# Altium project Havashenasi.PrjPcb
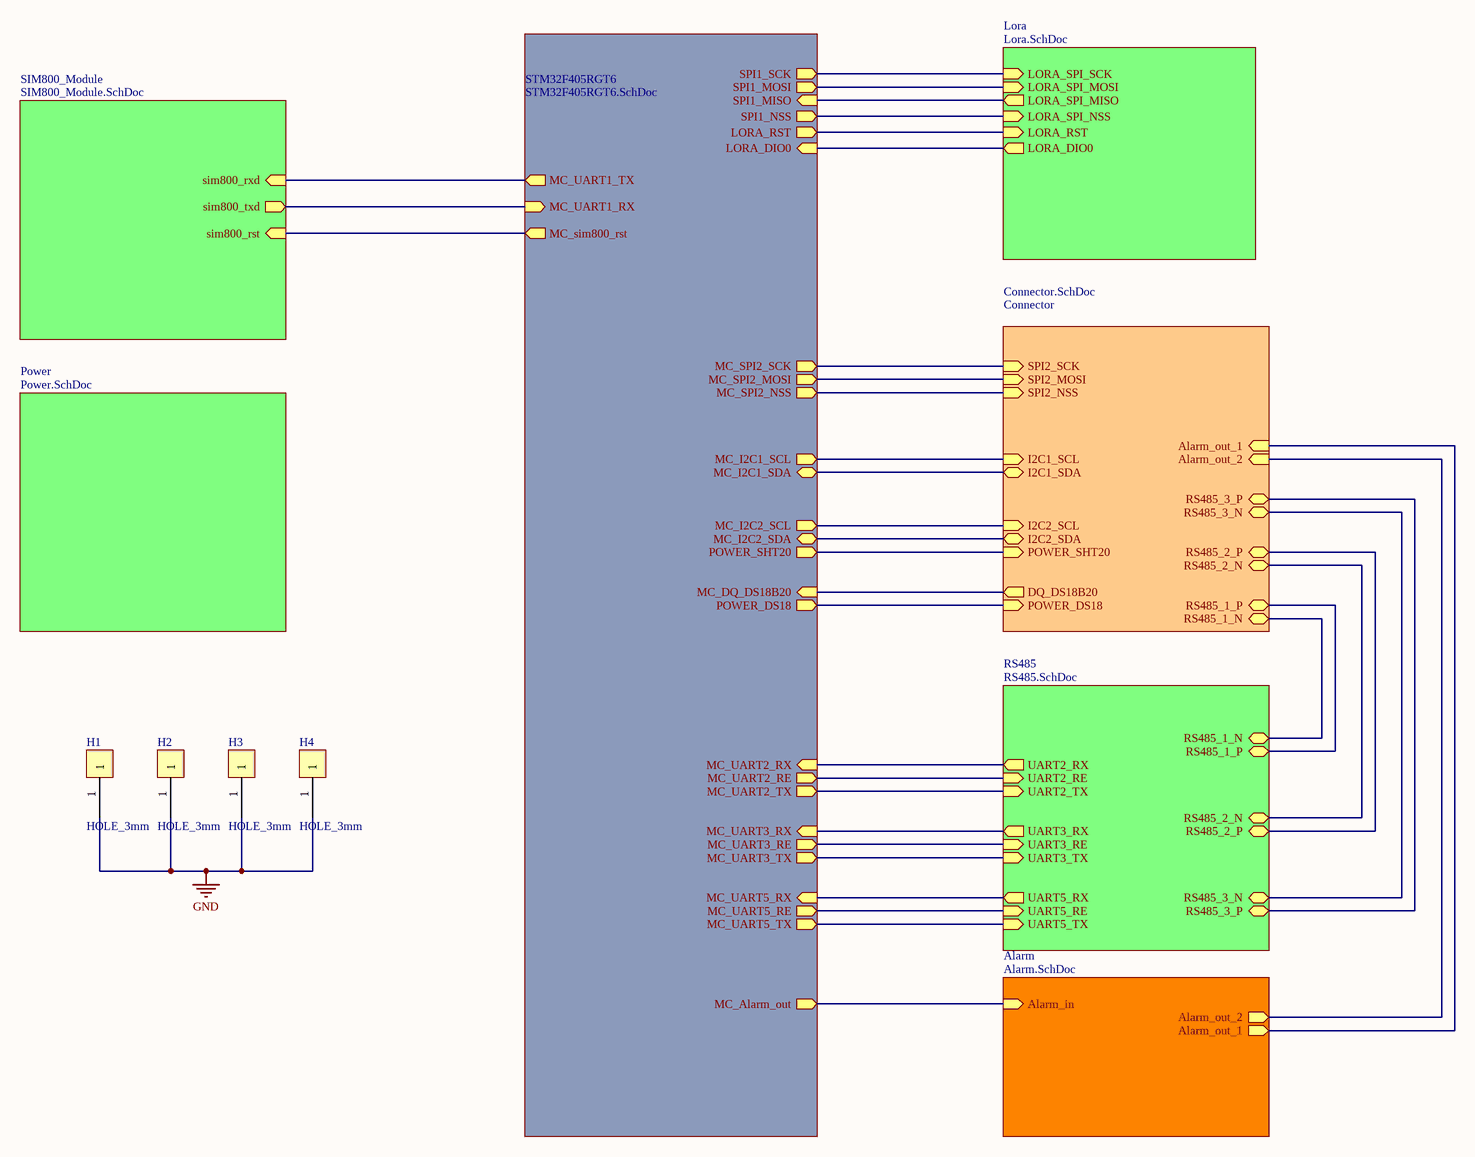
[diagram p0: Havashenasi.SchDoc]
8 sheets, 76 parts. Net scope: hierarchical (ports join the sheet entries above them; power ports are global).
Board file: Havashenasi.PcbDoc
Sheets:
  Havashenasi.SchDoc
    STM32F405RGT6 = STM32F405RGT6.SchDoc
    Power = Power.SchDoc
    SIM800_Module = SIM800_Module.SchDoc
    Connector = Connector.SchDoc
    RS485 = RS485.SchDoc
    Alarm = Alarm.SchDoc
    Lora = Lora.SchDoc

## Sheet Havashenasi.SchDoc
size A3

### Parts
H1  HOLE_3mm  [Hole_3mm]
H2  HOLE_3mm  [Hole_3mm]
H3  HOLE_3mm  [Hole_3mm]
H4  HOLE_3mm  [Hole_3mm]

### Sub-sheets
Alarm = Alarm.SchDoc: Alarm_out_2 (out), Alarm_out_1 (out), Alarm_in (in)
Connector = Connector.SchDoc: I2C2_SDA (bidir), I2C2_SCL (in), I2C1_SDA (bidir), I2C1_SCL (in), RS485_1_P (bidir), RS485_1_N (bidir), RS485_2_P (bidir), RS485_2_N (bidir), RS485_3_P (bidir), RS485_3_N (bidir), DQ_DS18B20 (out), Alarm_out_2 (in), Alarm_out_1 (in), SPI2_SCK (in), SPI2_MOSI (in), SPI2_NSS (in), POWER_SHT20 (in), POWER_DS18 (in)
Lora = Lora.SchDoc: LORA_SPI_MISO (out), LORA_RST (in), LORA_SPI_MOSI (in), LORA_SPI_SCK (in), LORA_SPI_NSS (in), LORA_DIO0 (out)
Power = Power.SchDoc: no entries
RS485 = RS485.SchDoc: UART3_RE (in), RS485_1_N (bidir), UART5_RE (in), UART2_TX (in), RS485_1_P (bidir), UART2_RE (in), UART3_TX (in), RS485_2_P (bidir), UART3_RX (out), RS485_2_N (bidir), UART2_RX (out), RS485_3_N (bidir), RS485_3_P (bidir), UART5_RX (out), UART5_TX (in)
SIM800_Module = SIM800_Module.SchDoc: sim800_rxd (in), sim800_txd (out), sim800_rst (in)
STM32F405RGT6 = STM32F405RGT6.SchDoc: MC_I2C2_SCL (out), MC_I2C2_SDA (bidir), MC_UART1_TX (out), MC_UART1_RX (in), MC_I2C1_SCL (out), MC_I2C1_SDA (bidir), MC_UART2_TX (out), MC_UART2_RX (in), MC_UART3_TX (out), MC_UART3_RX (in), MC_UART5_TX (out), MC_UART5_RX (in), MC_UART3_RE (out), MC_UART2_RE (out), MC_UART5_RE (out), MC_sim800_rst (out), MC_DQ_DS18B20 (in), MC_Alarm_out (out), MC_SPI2_MOSI (out), MC_SPI2_SCK (out), MC_SPI2_NSS (out), POWER_DS18 (out), POWER_SHT20 (out), SPI1_NSS (out), SPI1_SCK (out), SPI1_MISO (in), SPI1_MOSI (out), LORA_RST (out), LORA_DIO0 (in)

### Nets
GND: H1.1 H2.1 H3.1 H4.1
Alarm_out_1: sheet Connector/Alarm_out_1, sheet Alarm/Alarm_out_1
Alarm_out_2: sheet Connector/Alarm_out_2, sheet Alarm/Alarm_out_2
LORA_DIO0: sheet STM32F405RGT6/LORA_DIO0, sheet Lora/LORA_DIO0
LORA_RST: sheet STM32F405RGT6/LORA_RST, sheet Lora/LORA_RST
LORA_SPI_MISO: sheet STM32F405RGT6/SPI1_MISO, sheet Lora/LORA_SPI_MISO
LORA_SPI_MOSI: sheet STM32F405RGT6/SPI1_MOSI, sheet Lora/LORA_SPI_MOSI
LORA_SPI_NSS: sheet STM32F405RGT6/SPI1_NSS, sheet Lora/LORA_SPI_NSS
LORA_SPI_SCK: sheet STM32F405RGT6/SPI1_SCK, sheet Lora/LORA_SPI_SCK
MC_Alarm_out: sheet STM32F405RGT6/MC_Alarm_out, sheet Alarm/Alarm_in
MC_DQ_DS18B20: sheet STM32F405RGT6/MC_DQ_DS18B20, sheet Connector/DQ_DS18B20
MC_I2C1_SCL: sheet STM32F405RGT6/MC_I2C1_SCL, sheet Connector/I2C1_SCL
MC_I2C1_SDA: sheet STM32F405RGT6/MC_I2C1_SDA, sheet Connector/I2C1_SDA
MC_I2C2_SCL: sheet STM32F405RGT6/MC_I2C2_SCL, sheet Connector/I2C2_SCL
MC_I2C2_SDA: sheet STM32F405RGT6/MC_I2C2_SDA, sheet Connector/I2C2_SDA
MC_sim800_rst: sheet STM32F405RGT6/MC_sim800_rst, sheet SIM800_Module/sim800_rst
MC_SPI2_MOSI: sheet STM32F405RGT6/MC_SPI2_MOSI, sheet Connector/SPI2_MOSI
MC_SPI2_NSS: sheet STM32F405RGT6/MC_SPI2_NSS, sheet Connector/SPI2_NSS
MC_SPI2_SCK: sheet STM32F405RGT6/MC_SPI2_SCK, sheet Connector/SPI2_SCK
MC_UART1_RX: sheet STM32F405RGT6/MC_UART1_RX, sheet SIM800_Module/sim800_txd
MC_UART1_TX: sheet STM32F405RGT6/MC_UART1_TX, sheet SIM800_Module/sim800_rxd
MC_UART2_RX: sheet STM32F405RGT6/MC_UART2_RX, sheet RS485/UART2_RX
MC_UART2_TX: sheet STM32F405RGT6/MC_UART2_TX, sheet RS485/UART2_TX
MC_UART3_RX: sheet STM32F405RGT6/MC_UART3_RX, sheet RS485/UART3_RX
MC_UART3_TX: sheet STM32F405RGT6/MC_UART3_TX, sheet RS485/UART3_TX
MC_UART5_RX: sheet STM32F405RGT6/MC_UART5_RX, sheet RS485/UART5_RX
MC_UART5_TX: sheet STM32F405RGT6/MC_UART5_TX, sheet RS485/UART5_TX
RS485_1_N: sheet Connector/RS485_1_N, sheet RS485/RS485_1_N
RS485_1_P: sheet Connector/RS485_1_P, sheet RS485/RS485_1_P
RS485_2_N: sheet Connector/RS485_2_N, sheet RS485/RS485_2_N
RS485_2_P: sheet Connector/RS485_2_P, sheet RS485/RS485_2_P
RS485_3_N: sheet Connector/RS485_3_N, sheet RS485/RS485_3_N
RS485_3_P: sheet Connector/RS485_3_P, sheet RS485/RS485_3_P
UART2_RE: sheet STM32F405RGT6/MC_UART2_RE, sheet RS485/UART2_RE
UART3_RE: sheet STM32F405RGT6/MC_UART3_RE, sheet RS485/UART3_RE
UART5_RE: sheet STM32F405RGT6/MC_UART5_RE, sheet RS485/UART5_RE
(unnamed): sheet STM32F405RGT6/POWER_DS18, sheet Connector/POWER_DS18
(unnamed): sheet STM32F405RGT6/POWER_SHT20, sheet Connector/POWER_SHT20

## Sheet STM32F405RGT6.SchDoc
size A3
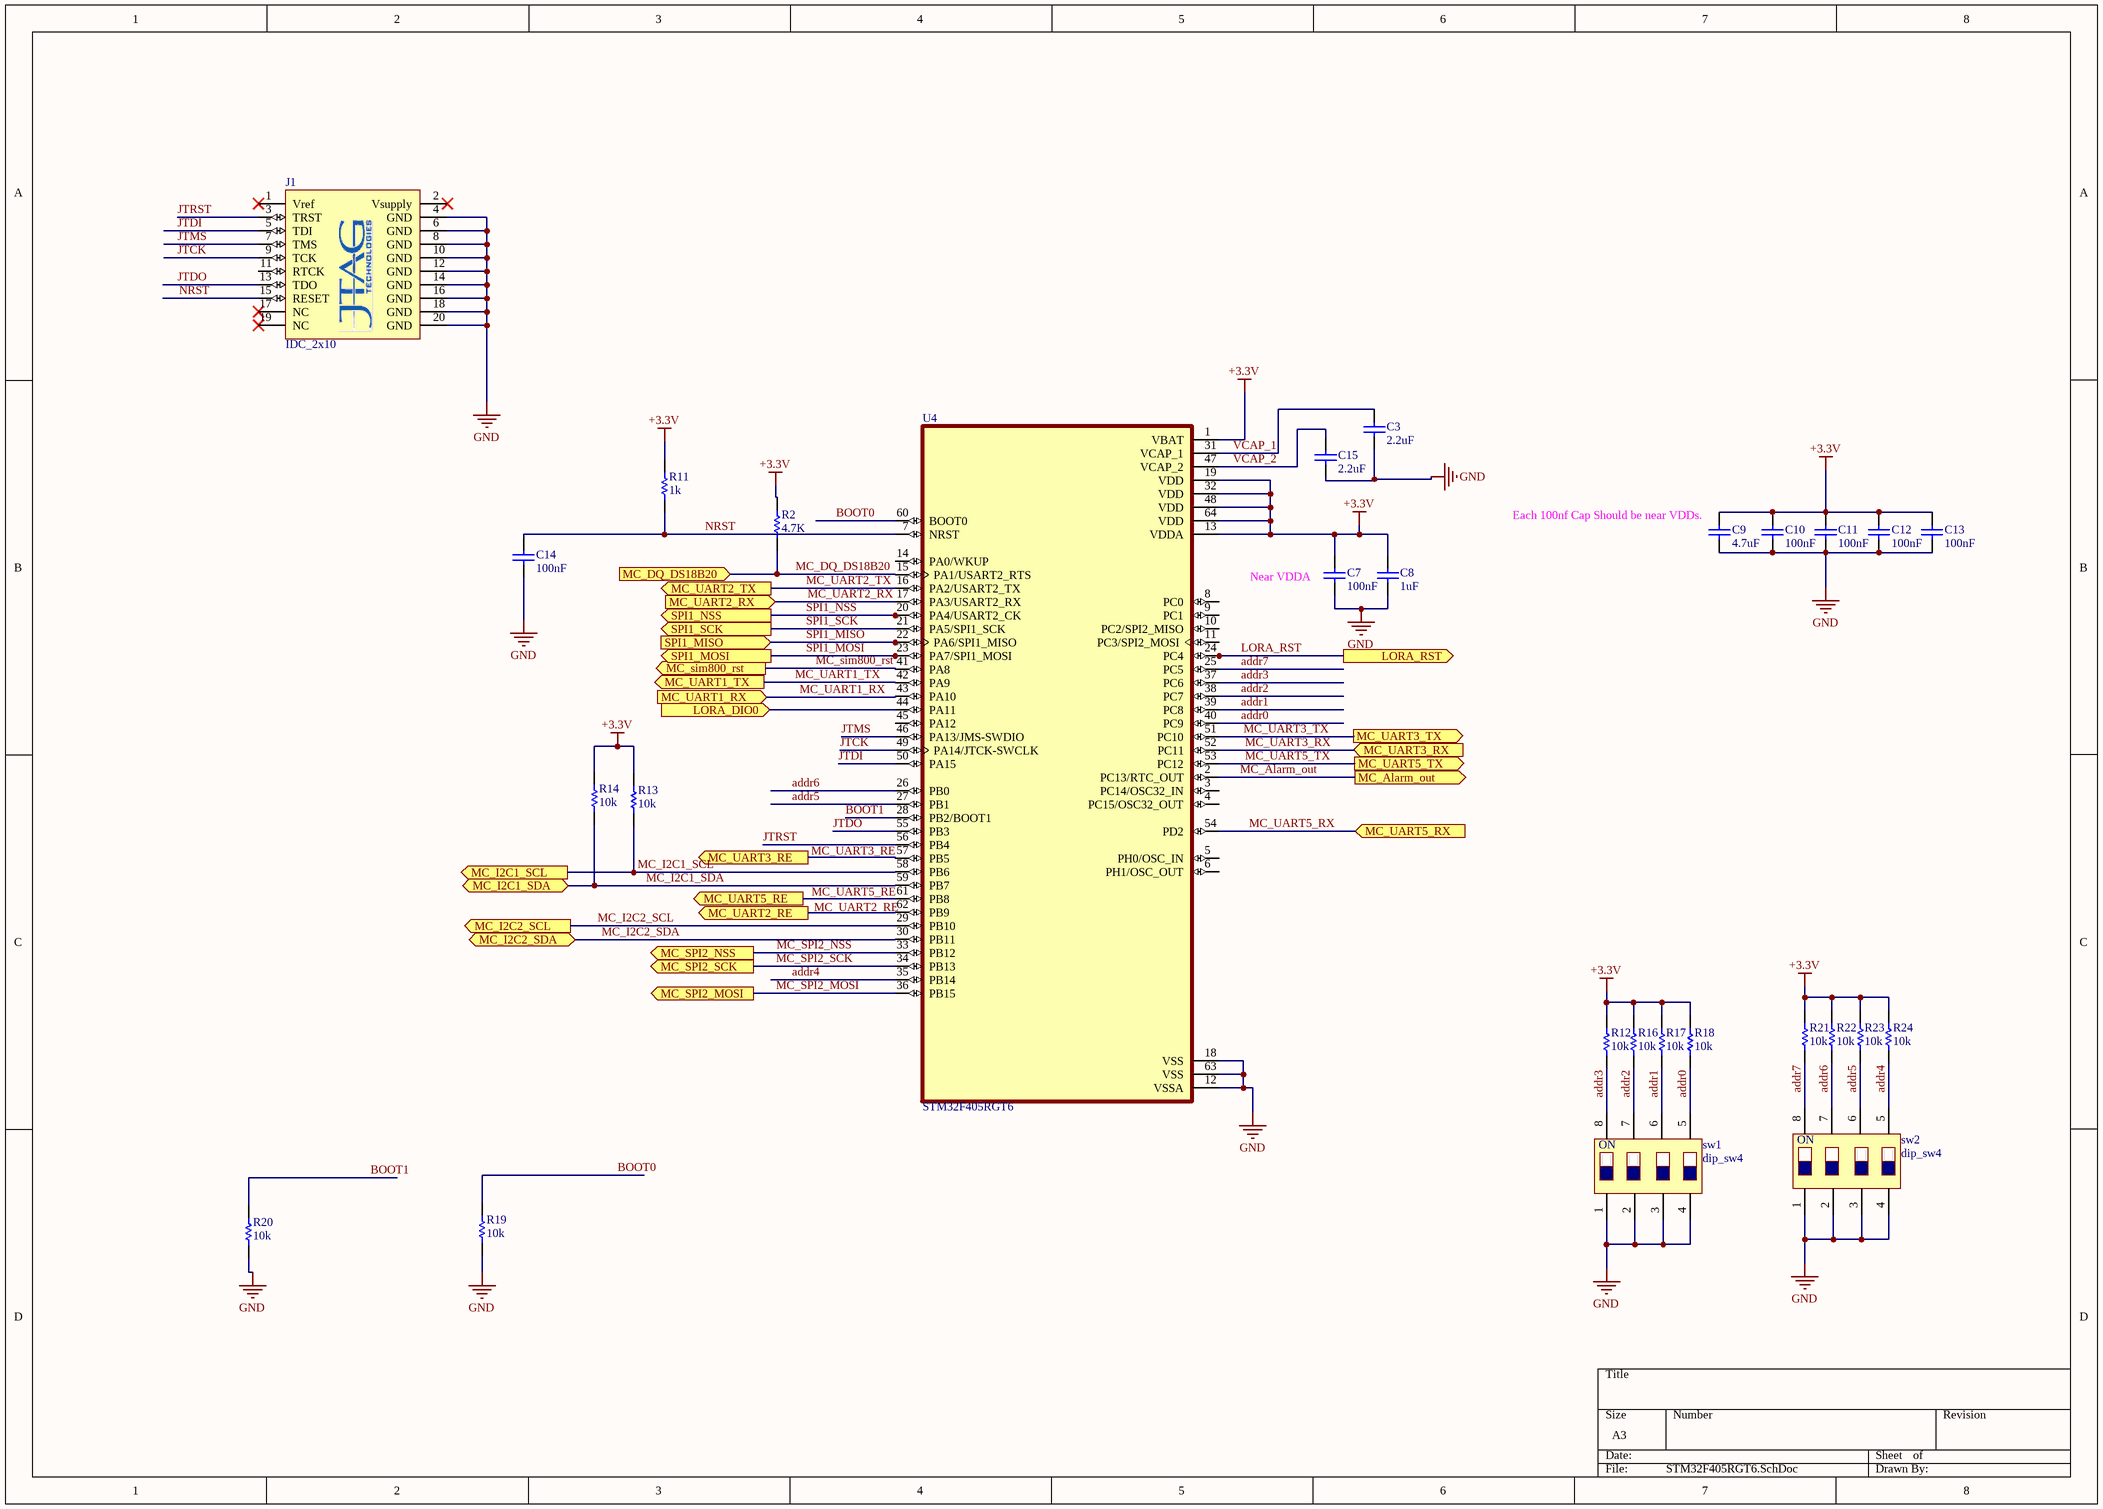
[diagram p1: STM32F405RGT6.SchDoc]

### Parts
C3  value 2.2uF  [C-805]  (hidden comment: C-805)
C7  value 100nF  [C-805]  (hidden comment: C-805)
C8  value 1uF  [C-805]  (hidden comment: C-805)
C9  value 4.7uF  [C-1206]  (hidden comment: C-1206)
C10  value 100nF  [C-603]  (hidden comment: C-603)
C11  value 100nF  [C-603]  (hidden comment: C-603)
C12  value 100nF  [C-603]  (hidden comment: C-603)
C13  value 100nF  [C-603]  (hidden comment: C-603)
C14  value 100nF  [C-805]  (hidden comment: C-805)
C15  value 2.2uF  [C-805]  (hidden comment: C-805)
J1  IDC_2x10  [IDC2.54-V20D]
R2  value 4.7K  [R-805]  (hidden comment: R-805)
R11  value 1k  [R-805]  (hidden comment: R-805)
R12  value 10k  [R-805]  (hidden comment: R-805)
R13  value 10k  [R-805]  (hidden comment: R-805)
R14  value 10k  [R-805]  (hidden comment: R-805)
R16  value 10k  [R-805]  (hidden comment: R-805)
R17  value 10k  [R-805]  (hidden comment: R-805)
R18  value 10k  [R-805]  (hidden comment: R-805)
R19  value 10k  [R-805]  (hidden comment: R-805)
R20  value 10k  [R-805]  (hidden comment: R-805)
R21  value 10k  [R-805]  (hidden comment: R-805)
R22  value 10k  [R-805]  (hidden comment: R-805)
R23  value 10k  [R-805]  (hidden comment: R-805)
R24  value 10k  [R-805]  (hidden comment: R-805)
sw1  dip_sw4  [dipSW_4]
sw2  dip_sw4  [dipSW_4]
U4  STM32F405RGT6  [stm32f405rgt6]

### Ports
LORA_DIO0 (in), LORA_RST (out), MC_Alarm_out (out), MC_DQ_DS18B20 (in), MC_I2C1_SCL (out), MC_I2C1_SDA (bidir), MC_I2C2_SCL (out), MC_I2C2_SDA (bidir), MC_sim800_rst (out), MC_SPI2_MOSI (out), MC_SPI2_NSS (out), MC_SPI2_SCK (out), MC_UART1_RX (in), MC_UART1_TX (out), MC_UART2_RE (out), MC_UART2_RX (in), MC_UART2_TX (out), MC_UART3_RE (out), MC_UART3_RX (in), MC_UART3_TX (out), MC_UART5_RE (out), MC_UART5_RX (in), MC_UART5_TX (out), SPI1_MISO (in), SPI1_MOSI (out), SPI1_NSS (out), SPI1_SCK (out)

### Nets
+3.3V: C7.1 C8.2 C9.2 C10.1 C11.1 C12.1 C13.1 R2.2 R11.2 R12.2 R13.2 R14.2 R16.2 R17.2 R18.2 R21.2 R22.2 R23.2 R24.2 U4.1(VBAT) U4.13(VDDA) U4.19(VDD) U4.32(VDD) U4.48(VDD) U4.64(VDD)
GND: C3.1 C7.2 C8.1 C9.1 C10.2 C11.2 C12.2 C13.2 C14.2 C15.1 J1.4(GND) J1.6(GND) J1.8(GND) J1.10(GND) J1.12(GND) J1.14(GND) J1.16(GND) J1.18(GND) J1.20(GND) R19.1 R20.2 sw1.1 sw1.2 sw1.3 sw1.4 sw2.1 sw2.2 sw2.3 sw2.4 U4.12(VSSA) U4.18(VSS) U4.63(VSS)
addr0: R18.1 sw1.5 U4.40(PC9)
addr1: R17.1 sw1.6 U4.39(PC8)
addr2: R16.1 sw1.7 U4.38(PC7)
addr3: R12.1 sw1.8 U4.37(PC6)
addr4: R24.1 sw2.5 U4.35(PB14)
addr5: R23.1 sw2.6 U4.27(PB1)
addr6: R22.1 sw2.7 U4.26(PB0)
addr7: R21.1 sw2.8 U4.25(PC5)
BOOT0: R19.2 U4.60(BOOT0)
BOOT1: R20.1 U4.28(PB2/BOOT1)
JTCK: J1.9(TCK) U4.49(PA14/JTCK-SWCLK)
JTDI: J1.5(TDI) U4.50(PA15)
JTDO: J1.13(TDO) U4.55(PB3)
JTMS: J1.7(TMS) U4.46(PA13/JMS-SWDIO)
JTRST: J1.3(TRST) U4.56(PB4)
LORA_DIO0: U4.44(PA11) ; port LORA_DIO0
LORA_RST: U4.24(PC4) ; port LORA_RST
MC_Alarm_out: U4.2(PC13/RTC_OUT) ; port MC_Alarm_out
MC_DQ_DS18B20: R2.1 U4.15(PA1/USART2_RTS) ; port MC_DQ_DS18B20
MC_I2C1_SCL: R13.1 U4.58(PB6) ; port MC_I2C1_SCL
MC_I2C1_SDA: R14.1 U4.59(PB7) ; port MC_I2C1_SDA
MC_I2C2_SCL: U4.29(PB10) ; port MC_I2C2_SCL
MC_I2C2_SDA: U4.30(PB11) ; port MC_I2C2_SDA
MC_sim800_rst: U4.41(PA8) ; port MC_sim800_rst
MC_SPI2_MOSI: U4.36(PB15) ; port MC_SPI2_MOSI
MC_SPI2_NSS: U4.33(PB12) ; port MC_SPI2_NSS
MC_SPI2_SCK: U4.34(PB13) ; port MC_SPI2_SCK
MC_UART1_RX: U4.43(PA10) ; port MC_UART1_RX
MC_UART1_TX: U4.42(PA9) ; port MC_UART1_TX
MC_UART2_RX: U4.17(PA3/USART2_RX) ; port MC_UART2_RX
MC_UART2_TX: U4.16(PA2/USART2_TX) ; port MC_UART2_TX
MC_UART3_RX: U4.52(PC11) ; port MC_UART3_RX
MC_UART3_TX: U4.51(PC10) ; port MC_UART3_TX
MC_UART5_RX: U4.54(PD2) ; port MC_UART5_RX
MC_UART5_TX: U4.53(PC12) ; port MC_UART5_TX
NRST: C14.1 J1.15(RESET) R11.1 U4.7(NRST)
SPI1_MISO: U4.22(PA6/SPI1_MISO) ; port SPI1_MISO  [project net LORA_SPI_MISO]
SPI1_MOSI: U4.23(PA7/SPI1_MOSI) ; port SPI1_MOSI  [project net LORA_SPI_MOSI]
SPI1_NSS: U4.20(PA4/USART2_CK) ; port SPI1_NSS  [project net LORA_SPI_NSS]
SPI1_SCK: U4.21(PA5/SPI1_SCK) ; port SPI1_SCK  [project net LORA_SPI_SCK]
UART2_RE: U4.62(PB9) ; port MC_UART2_RE
UART3_RE: U4.57(PB5) ; port MC_UART3_RE
UART5_RE: U4.61(PB8) ; port MC_UART5_RE
VCAP_1: C3.2 U4.31(VCAP_1)
VCAP_2: C15.2 U4.47(VCAP_2)

Not connected (* = marked no-connect by the designer): J1 1(Vref)* 2(Vsupply)* 11(RTCK) 17(NC)* 19(NC)*; U4 3(PC14/OSC32_IN) 4(PC15/OSC32_OUT) 5(PH0/OSC_IN) 6(PH1/OSC_OUT) 8(PC0) 9(PC1) 10(PC2/SPI2_MISO) 11(PC3/SPI2_MOSI) 14(PA0/WKUP) 45(PA12)

### Notes on the sheet
- (near C9) Each 100nf Cap Should be near VDDs.
- (near C7) Near VDDA
- Labels drawn without touching a wire or pin: MC_UART2_RE, MC_UART3_RE, MC_UART5_RE
- (in symbol dip_sw4) ON

### Library data of the parts
C3 C7 C8 C14 C15 = C-805: Capacitor; Published: 8-Jun-2000; LatestRevisionDate: 29-May-2009; LatestRevisionNote: IPC-7351 Footprint Added.; PackageReference: C1206; Publisher: Altium Limited; PackageDescription: Chip Capacitor
C9 = C-1206: Capacitor; Published: 8-Jun-2000; LatestRevisionDate: 29-May-2009; LatestRevisionNote: IPC-7351 Footprint Added.; PackageReference: C1206; Publisher: Altium Limited; PackageDescription: Chip Capacitor
C10-C13 = C-603: Capacitor; Published: 8-Jun-2000; LatestRevisionDate: 29-May-2009; LatestRevisionNote: IPC-7351 Footprint Added.; PackageReference: C1206; Publisher: Altium Limited; PackageDescription: Chip Capacitor
J1 = JTAG_JLINK: 20 Pin Standard JTAG Header For ARM JLINK; Company: SJ Libraries; Connector type: IDC2.54-20; designer: Eng. Saeid Jorablo; Max Current: mA; Positions: 20; Revision 1: 7/8/2012: Create Model; Category: Headers; ComponentLink1Description: Datasheet; ComponentLink2Description: Reference; Mounting Technology: Through-Hole; Orientation: Vertical; Pin Count: 20; Publisher: SJ UnLimited; Status: Unreleased; Update: 7/8/2012; HelpURL: http://s3.picofile.com/file/7443264187/Coming_Soon_logo.gif
R2 R11-R14 R16-R24 = R-805: Resistor
sw1 sw2 = dip_sw4: dip switch, 4-Pin; LatestRevisionDate: 17-Jul-2002; LatestRevisionNote: Re-released for DXP Platform.; Publisher: Altium Limited
U4 = STM32F405RGT6: ARMÂ® CortexÂ®-M4 STM32F4 Microcontroller IC 32-Bit 168MHz 1MB _1M x 8_ FLASH 64-LQFP _10x10_; MF: STMicroelectronics; Package: LQFP-64 STMicroelectronics; Digi-Key_Purchase_URL: https://www.digikey.com/product-detail/en/stmicroelectronics/STM32F405RGT6/497-11767-ND/2754208?utm_source=snapeda&utm_medium=aggregator&utm_campaign=symbol; Value: *; MP: STM32F405RGT6; SnapEDA_Link: https://www.snapeda.com/parts/STM32F405RGT6/STMicroelectronics/view-part/105502/?ref=snap; Digi-Key_Part_Number: 497-11767-ND

## Sheet Power.SchDoc
size A3
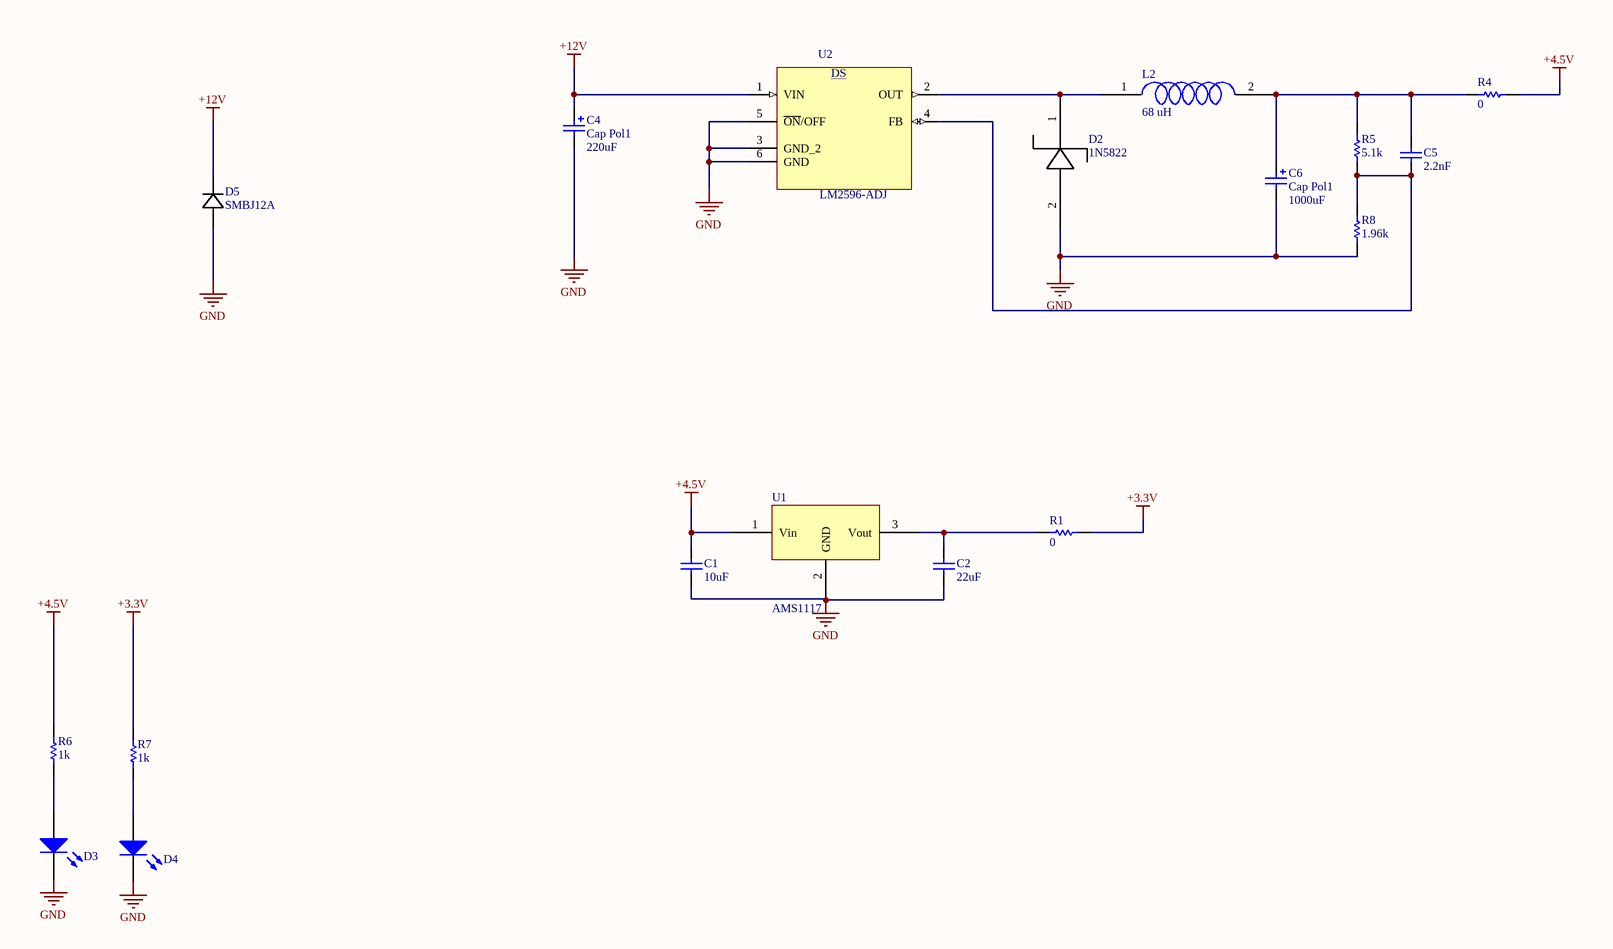
[diagram p2: Power.SchDoc]

### Parts
C1  value 10uF  [C-1206]  (hidden comment: C-1206)
C2  value 22uF  [C-1206]  (hidden comment: C-1206)
C4  Cap Pol1  value 220uF  [RB5-10.5]
C5  value 2.2nF  [C-805]  (hidden comment: C-805)
C6  Cap Pol1  value 1000uF  [RB5-10.5]
D2  1N5822  [1N5822]
D3  LED-805  [LED-805]  (value not drawn)
D4  LED-805  [LED-805]  (value not drawn)
D5  SMBJ12A  [SMB]
L2  68 uH  [Inductor]
R1  value 0  [R-1206]  (hidden comment: R-1206)
R4  value 0  [R-1206]  (hidden comment: R-1206)
R5  value 5.1k  [R-805]  (hidden comment: R-805)
R6  value 1k  [R-805]  (hidden comment: R-805)
R7  value 1k  [R-805]  (hidden comment: R-805)
R8  value 1.96k  [R-805]  (hidden comment: R-805)
U1  AMS1117  [AMS1117]
U2  LM2596-ADJ  [LM2596SX]

### Nets
+3.3V: R1.2 R7.2
+4.5V: C1.2 R4.2 R6.2 U1.1(Vin)
+12V: C4.1 D5.1 U2.1(VIN)
GND: C1.1 C2.1 C4.2 C6.2 D2.2 D3.2(K) D4.2(K) D5.2 R8.2 U1.2(GND) U2.3(GND_2) U2.5(~{ON}/OFF) U2.6(GND)
NetC2_2: C2.2 R1.1 U1.3(Vout)
NetC5_1: C5.1 R5.2 R8.1 U2.4(FB)
NetC5_2: C5.2 C6.1 L2.2 R4.1 R5.1
NetD2_1: D2.1 L2.1 U2.2(OUT)
NetD3_1: D3.1(A) R6.1
NetD4_1: D4.1(A) R7.1

### Notes on the sheet
- (in symbol LM2596-ADJ) DS

### Library data of the parts
C1 C2 = C-1206: Capacitor; Published: 8-Jun-2000; LatestRevisionDate: 29-May-2009; LatestRevisionNote: IPC-7351 Footprint Added.; PackageReference: C1206; Publisher: Altium Limited; PackageDescription: Chip Capacitor
C4 C6 = Cap Pol1: Polarized Capacitor (Radial); Published: 8-Jun-2000; LatestRevisionDate: 17-Jul-2002; LatestRevisionNote: Re-released for DXP Platform.; PackageReference: RB7.6-15; Publisher: Altium Limited; PackageDescription: Polarized Capacitor (Radial); 2 Leads
C5 = C-805: Capacitor; Published: 8-Jun-2000; LatestRevisionDate: 29-May-2009; LatestRevisionNote: IPC-7351 Footprint Added.; PackageReference: C1206; Publisher: Altium Limited; PackageDescription: Chip Capacitor
D3 D4 = LED-805: LED Size 805; Published: 8-Jun-2000; LatestRevisionDate: 17-Jul-2002; LatestRevisionNote: Re-released for DXP Platform.; PackageVersion: Feb-2002; PackageReference: 3.2X1.6X1.1; Publisher: Altium Limited; PackageDescription: SM LED; 2 Flat Leads
D5 = SMBJ12A: No Description Available; Manufacturer_Part_Number: SMBJ12A-13-F; Vendor: Diodes Inc; Built_By: EMA_UL_Team; Type: DEV; Copyright: Copyright (C) 2018 Accelerated Designs. All rights reserved; RefDes: RefDes; Value: Value
L2 = Inductor: Power inductor
R1 R4 = R-1206: Resistor
R5-R8 = R-805: Resistor
U1 = AMS1117: 3.3v regulator
U2 = LM2596-ADJ: SIMPLE SWITCHER Power Converter 150 KHz 3A Step-Down Voltage Regulator 5-DDPAK/TO-263; MF: Texas Instruments; MP: LM2596-ADJ; Package: TO-263-6 Texas Instruments; SnapEDA_Link: https://www.snapeda.com/parts/LM2596SX-12/Texas%20Instruments/view-part/?ref=snap; Price: 1.83 USD; Availability: Unavailable; Value: *

## Sheet SIM800_Module.SchDoc
size A
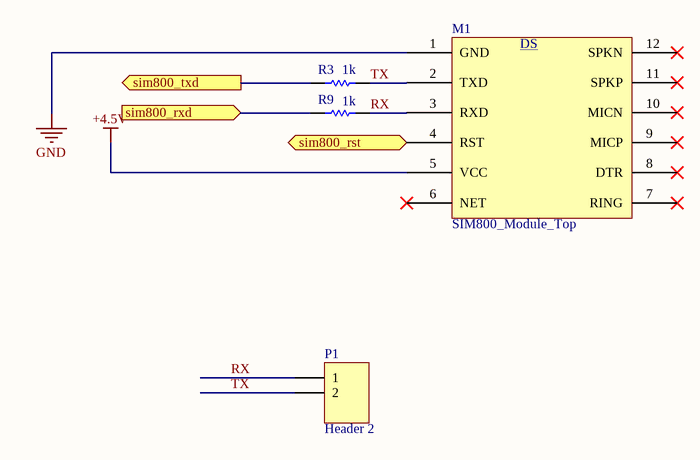
[diagram p3: SIM800_Module.SchDoc]

### Parts
M1  SIM800_Module_Top  [SIM800_Module_Top]
P1  Header 2  [HDR1X2]
R3  value 1k  [R-805]  (hidden comment: R-805)
R9  value 1k  [R-805]  (hidden comment: R-805)

### Ports
sim800_rst (in), sim800_rxd (in), sim800_txd (out)

### Nets
+4.5V: M1.5(VCC)
GND: M1.1(GND)
MC_sim800_rst: M1.4(RST) ; port sim800_rst
MC_UART1_RX: R3.2 ; port sim800_txd
MC_UART1_TX: R9.2 ; port sim800_rxd
RX: M1.3(RXD) P1.1 R9.1
TX: M1.2(TXD) P1.2 R3.1

Not connected (* = marked no-connect by the designer): M1 6(NET)* 7(RING)* 8(DTR)* 9(MICP)* 10(MICN)* 11(SPKP)* 12(SPKN)*

### Notes on the sheet
- (in symbol SIM800_Module_Top) DS

### Library data of the parts
P1 = Header 2: Header, 3-Pin; LatestRevisionDate: 17-Jul-2002; LatestRevisionNote: Re-released for DXP Platform.; Publisher: Altium Limited
R3 R9 = R-805: Resistor

## Sheet Connector.SchDoc
size A
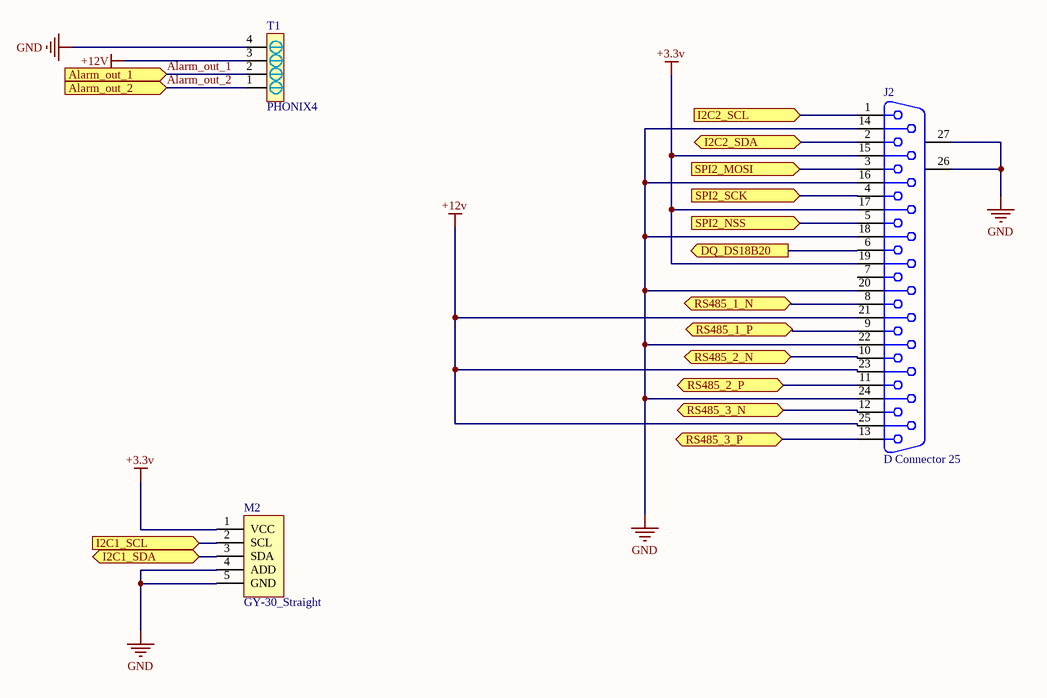
[diagram p4: Connector.SchDoc]

### Parts
J2  D Connector 25  [DSUB1.385-2H25A]
M2  GY-30_Straight  [GY-30_Straight]
T1  PHONIX4  [PHONIX4]

### Ports
Alarm_out_1 (in), Alarm_out_2 (in), DQ_DS18B20 (out), I2C1_SCL (in), I2C1_SDA (bidir), I2C2_SCL (in), I2C2_SDA (bidir), RS485_1_N (bidir), RS485_1_P (bidir), RS485_2_N (bidir), RS485_2_P (bidir), RS485_3_N (bidir), RS485_3_P (bidir), SPI2_MOSI (in), SPI2_NSS (in), SPI2_SCK (in)

### Nets
+3.3V: J2.15 J2.17 J2.19 M2.1(VCC)
+12V: J2.21 J2.23 J2.25 T1.3
GND: J2.14 J2.16 J2.18 J2.20 J2.22 J2.24 J2.26(MH1) J2.27(MH2) M2.4(ADD) M2.5(GND) T1.4
Alarm_out_1: T1.2 ; port Alarm_out_1
Alarm_out_2: T1.1 ; port Alarm_out_2
MC_DQ_DS18B20: J2.6 ; port DQ_DS18B20
MC_I2C1_SCL: M2.2(SCL) ; port I2C1_SCL
MC_I2C1_SDA: M2.3(SDA) ; port I2C1_SDA
MC_I2C2_SCL: J2.1 ; port I2C2_SCL
MC_I2C2_SDA: J2.2 ; port I2C2_SDA
MC_SPI2_MOSI: J2.3 ; port SPI2_MOSI
MC_SPI2_NSS: J2.5 ; port SPI2_NSS
MC_SPI2_SCK: J2.4 ; port SPI2_SCK
RS485_1_N: J2.8 ; port RS485_1_N
RS485_1_P: J2.9 ; port RS485_1_P
RS485_2_N: J2.10 ; port RS485_2_N
RS485_2_P: J2.11 ; port RS485_2_P
RS485_3_N: J2.12 ; port RS485_3_N
RS485_3_P: J2.13 ; port RS485_3_P

Not connected (* = marked no-connect by the designer): J2 7

### Library data of the parts
J2 = D Connector 25: Receptacle Assembly, 25 Position, Right Angle; PackageDocument: U; Positions: 25; Published: 15-Jun-2001; LatestRevisionDate: 17-Jul-2002; LatestRevisionNote: Re-released for DXP Platform.; DatasheetDocument: 19-Mar-1999; PackageReference: 787202; Publisher: Altium Limited; Orientation: Right Angle; Gender: Receptacle
M2 = GY-30_Straight: LatestRevisionDate: 17-Jul-2002; LatestRevisionNote: Re-released for DXP Platform.; Publisher: Altium Limited

## Sheet RS485.SchDoc
size A3
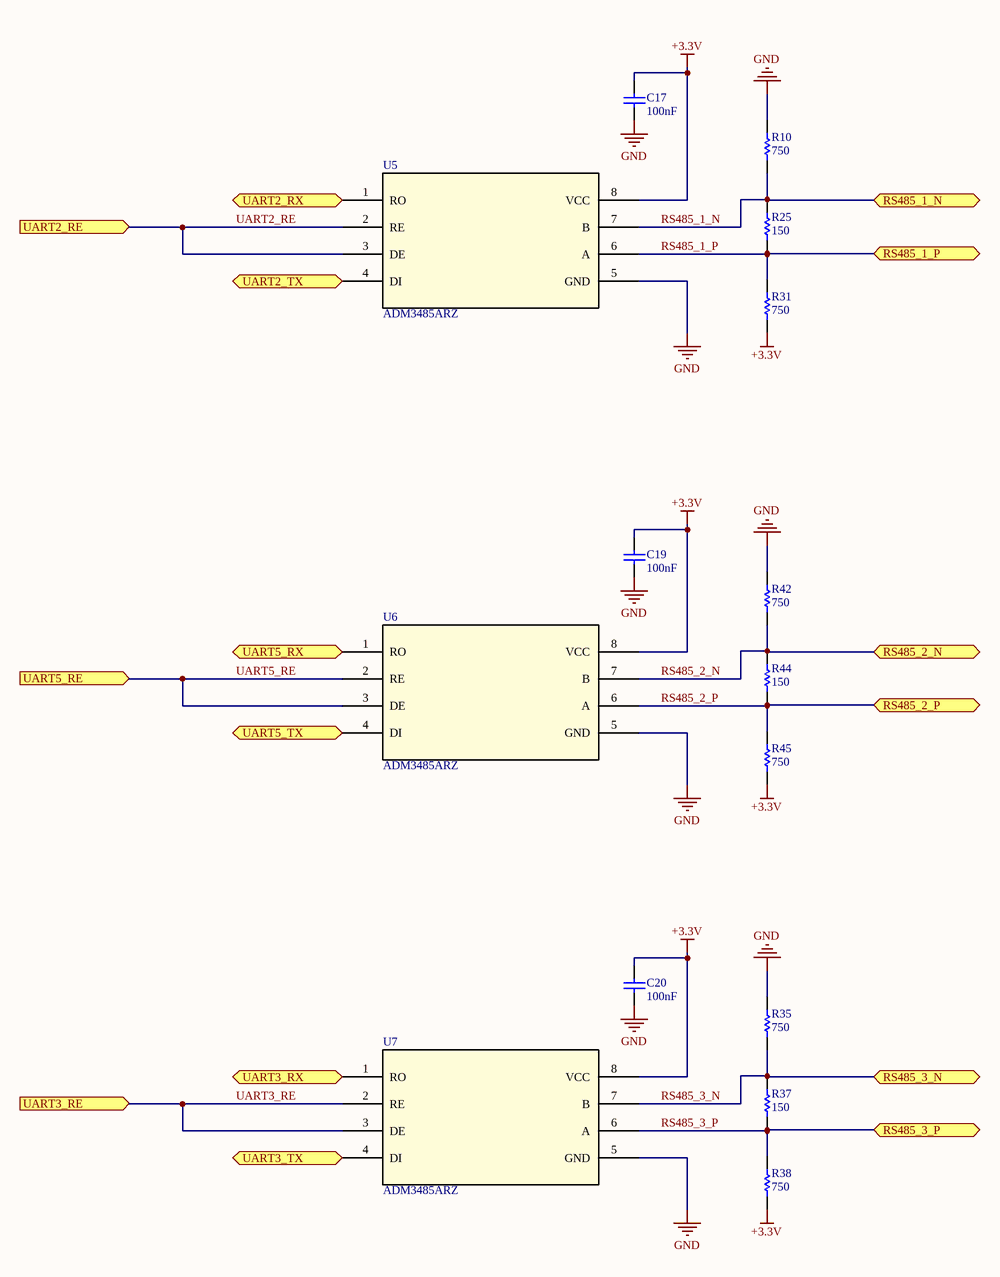
[diagram p5: RS485.SchDoc]

### Parts
C17  value 100nF  [C-805]  (hidden comment: C-805)
C19  value 100nF  [C-805]  (hidden comment: C-805)
C20  value 100nF  [C-805]  (hidden comment: C-805)
R10  value 750  [R-805]  (hidden comment: R-805)
R25  value 150  [R-805]  (hidden comment: R-805)
R31  value 750  [R-805]  (hidden comment: R-805)
R35  value 750  [R-805]  (hidden comment: R-805)
R37  value 150  [R-805]  (hidden comment: R-805)
R38  value 750  [R-805]  (hidden comment: R-805)
R42  value 750  [R-805]  (hidden comment: R-805)
R44  value 150  [R-805]  (hidden comment: R-805)
R45  value 750  [R-805]  (hidden comment: R-805)
U5  ADM3485ARZ  [R_8]
U6  ADM3485ARZ  [R_8]
U7  ADM3485ARZ  [R_8]

### Ports
RS485_1_N (bidir), RS485_1_P (bidir), RS485_2_N (bidir), RS485_2_P (bidir), RS485_3_N (bidir), RS485_3_P (bidir), UART2_RE (in), UART2_RX (out), UART2_TX (in), UART3_RE (in), UART3_RX (out), UART3_TX (in), UART5_RE (in), UART5_RX (out), UART5_TX (in)

### Nets
+3.3V: C17.2 C19.2 C20.2 R31.1 R38.1 R45.1 U5.8(VCC) U6.8(VCC) U7.8(VCC)
GND: C17.1 C19.1 C20.1 R10.2 R35.2 R42.2 U5.5(GND) U6.5(GND) U7.5(GND)
MC_UART2_RX: U5.1(RO) ; port UART2_RX
MC_UART2_TX: U5.4(DI) ; port UART2_TX
MC_UART3_RX: U7.1(RO) ; port UART3_RX
MC_UART3_TX: U7.4(DI) ; port UART3_TX
MC_UART5_RX: U6.1(RO) ; port UART5_RX
MC_UART5_TX: U6.4(DI) ; port UART5_TX
RS485_1_N: R10.1 R25.2 U5.7(B) ; port RS485_1_N
RS485_1_P: R25.1 R31.2 U5.6(A) ; port RS485_1_P
RS485_2_N: R42.1 R44.2 U6.7(B) ; port RS485_2_N
RS485_2_P: R44.1 R45.2 U6.6(A) ; port RS485_2_P
RS485_3_N: R35.1 R37.2 U7.7(B) ; port RS485_3_N
RS485_3_P: R37.1 R38.2 U7.6(A) ; port RS485_3_P
UART2_RE: U5.2(RE) U5.3(DE) ; port UART2_RE
UART3_RE: U7.2(RE) U7.3(DE) ; port UART3_RE
UART5_RE: U6.2(RE) U6.3(DE) ; port UART5_RE

### Library data of the parts
C17 C19 C20 = C-805: Capacitor; Published: 8-Jun-2000; LatestRevisionDate: 29-May-2009; LatestRevisionNote: IPC-7351 Footprint Added.; PackageReference: C1206; Publisher: Altium Limited; PackageDescription: Chip Capacitor
R10 R25 R31 R35 R37 R38 R42 R44 R45 = R-805: Resistor
U5-U7 = ADM3485ARZ: No Description Available; Vendor: Analog Devices Inc; Built_By: EMA_UL_Team; Manufacturer_Part_Number: ADM3485ARZ; Copyright: Copyright (C) 2018 Accelerated Designs. All rights reserved; RefDes: RefDes; Type: DEV; Value: Value

## Sheet Alarm.SchDoc
size A
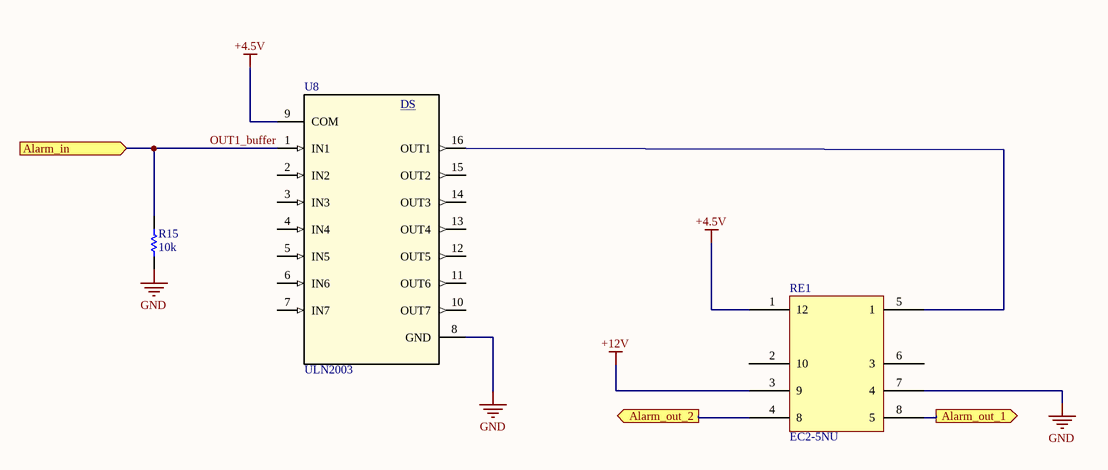
[diagram p6: Alarm.SchDoc]

### Parts
R15  value 10k  [R-805]  (hidden comment: R-805)
RE1  EC2-5NU  [EC2-5NU]
U8  ULN2003  [ULN20003]

### Ports
Alarm_in (in), Alarm_out_1 (out), Alarm_out_2 (out)

### Nets
+4.5V: RE1.1(12) U8.9(COM)
+12V: RE1.3(9)
GND: R15.1 RE1.7(4) U8.8(GND)
Alarm_out_1: RE1.8(5) ; port Alarm_out_1
Alarm_out_2: RE1.4(8) ; port Alarm_out_2
OUT1_buffer: R15.2 U8.1(IN1) ; port Alarm_in  [project net MC_Alarm_out]
NetRE1_5: RE1.5(1) U8.16(OUT1)

Not connected (* = marked no-connect by the designer): RE1 2(10) 6(3); U8 2(IN2) 3(IN3) 4(IN4) 5(IN5) 6(IN6) 7(IN7) 10(OUT7) 11(OUT6) 12(OUT5) 13(OUT4) 14(OUT3) 15(OUT2)

### Notes on the sheet
- (in symbol ULN2003) DS

### Library data of the parts
R15 = R-805: Resistor
RE1 = EC2_5NU
U8 = ULN2003: No Description Available; PartNumber: ULN2003ADR; Manufacturer: Texas Instruments; RefDes: RefDes; Type: DEV; Value: Value; Copyright: Copyright (C) 2018 Accelerated Designs. All rights reserved

## Sheet Lora.SchDoc
size A
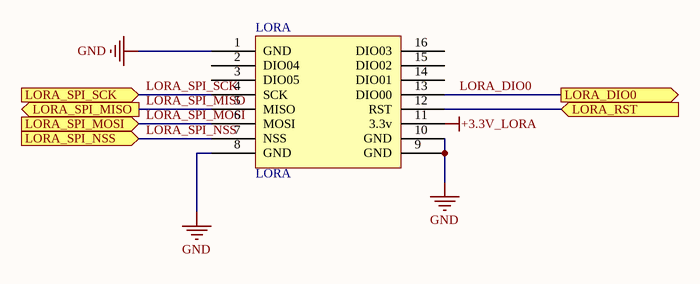
[diagram p7: Lora.SchDoc]

### Parts
LORA  LORA  [LORA-RA2-SMD]

### Ports
LORA_DIO0 (out), LORA_RST (in), LORA_SPI_MISO (out), LORA_SPI_MOSI (in), LORA_SPI_NSS (in), LORA_SPI_SCK (in)

### Nets
+3.3V_LORA: LORA.11(3.3v)
GND: LORA.1(GND) LORA.8(GND) LORA.9(GND) LORA.10(GND)
LORA_DIO0: LORA.13(DIO00) ; port LORA_DIO0
LORA_RST: LORA.12(RST) ; port LORA_RST
LORA_SPI_MISO: LORA.5(MISO) ; port LORA_SPI_MISO
LORA_SPI_MOSI: LORA.6(MOSI) ; port LORA_SPI_MOSI
LORA_SPI_NSS: LORA.7(NSS) ; port LORA_SPI_NSS
LORA_SPI_SCK: LORA.4(SCK) ; port LORA_SPI_SCK

Not connected (* = marked no-connect by the designer): LORA 2(DIO04) 3(DIO05) 14(DIO01) 15(DIO02) 16(DIO03)

## Nets that join several sheets
+3.3V: STM32F405RGT6 (25 pins), Power (R1.2 R7.2), Connector (J2.15 J2.17 J2.19 M2.1), RS485 (9 pins)
+4.5V: Power (C1.2 R4.2 R6.2 U1.1), SIM800_Module (M1.5), Alarm (RE1.1 U8.9)
+12V: Power (C4.1 D5.1 U2.1), Connector (J2.21 J2.23 J2.25 T1.3), Alarm (RE1.3)
GND: Havashenasi (H1.1 H2.1 H3.1 H4.1), STM32F405RGT6 (32 pins), Power (13 pins), SIM800_Module (M1.1), Connector (11 pins), RS485 (9 pins), Alarm (R15.1 RE1.7 U8.8), Lora (LORA.1 LORA.8 LORA.9 LORA.10)
Alarm_out_1: Connector (T1.2), Alarm (RE1.8)
Alarm_out_2: Connector (T1.1), Alarm (RE1.4)
LORA_DIO0: STM32F405RGT6 (U4.44), Lora (LORA.13)
LORA_RST: STM32F405RGT6 (U4.24), Lora (LORA.12)
LORA_SPI_MISO: STM32F405RGT6 (U4.22), Lora (LORA.5)
LORA_SPI_MOSI: STM32F405RGT6 (U4.23), Lora (LORA.6)
LORA_SPI_NSS: STM32F405RGT6 (U4.20), Lora (LORA.7)
LORA_SPI_SCK: STM32F405RGT6 (U4.21), Lora (LORA.4)
MC_Alarm_out: STM32F405RGT6 (U4.2), Alarm (R15.2 U8.1)
MC_DQ_DS18B20: STM32F405RGT6 (R2.1 U4.15), Connector (J2.6)
MC_I2C1_SCL: STM32F405RGT6 (R13.1 U4.58), Connector (M2.2)
MC_I2C1_SDA: STM32F405RGT6 (R14.1 U4.59), Connector (M2.3)
MC_I2C2_SCL: STM32F405RGT6 (U4.29), Connector (J2.1)
MC_I2C2_SDA: STM32F405RGT6 (U4.30), Connector (J2.2)
MC_sim800_rst: STM32F405RGT6 (U4.41), SIM800_Module (M1.4)
MC_SPI2_MOSI: STM32F405RGT6 (U4.36), Connector (J2.3)
MC_SPI2_NSS: STM32F405RGT6 (U4.33), Connector (J2.5)
MC_SPI2_SCK: STM32F405RGT6 (U4.34), Connector (J2.4)
MC_UART1_RX: STM32F405RGT6 (U4.43), SIM800_Module (R3.2)
MC_UART1_TX: STM32F405RGT6 (U4.42), SIM800_Module (R9.2)
MC_UART2_RX: STM32F405RGT6 (U4.17), RS485 (U5.1)
MC_UART2_TX: STM32F405RGT6 (U4.16), RS485 (U5.4)
MC_UART3_RX: STM32F405RGT6 (U4.52), RS485 (U7.1)
MC_UART3_TX: STM32F405RGT6 (U4.51), RS485 (U7.4)
MC_UART5_RX: STM32F405RGT6 (U4.54), RS485 (U6.1)
MC_UART5_TX: STM32F405RGT6 (U4.53), RS485 (U6.4)
RS485_1_N: Connector (J2.8), RS485 (R10.1 R25.2 U5.7)
RS485_1_P: Connector (J2.9), RS485 (R25.1 R31.2 U5.6)
RS485_2_N: Connector (J2.10), RS485 (R42.1 R44.2 U6.7)
RS485_2_P: Connector (J2.11), RS485 (R44.1 R45.2 U6.6)
RS485_3_N: Connector (J2.12), RS485 (R35.1 R37.2 U7.7)
RS485_3_P: Connector (J2.13), RS485 (R37.1 R38.2 U7.6)
UART2_RE: STM32F405RGT6 (U4.62), RS485 (U5.2 U5.3)
UART3_RE: STM32F405RGT6 (U4.57), RS485 (U7.2 U7.3)
UART5_RE: STM32F405RGT6 (U4.61), RS485 (U6.2 U6.3)